# Altium schematic sheet Sheet1.SchDoc
size Letter
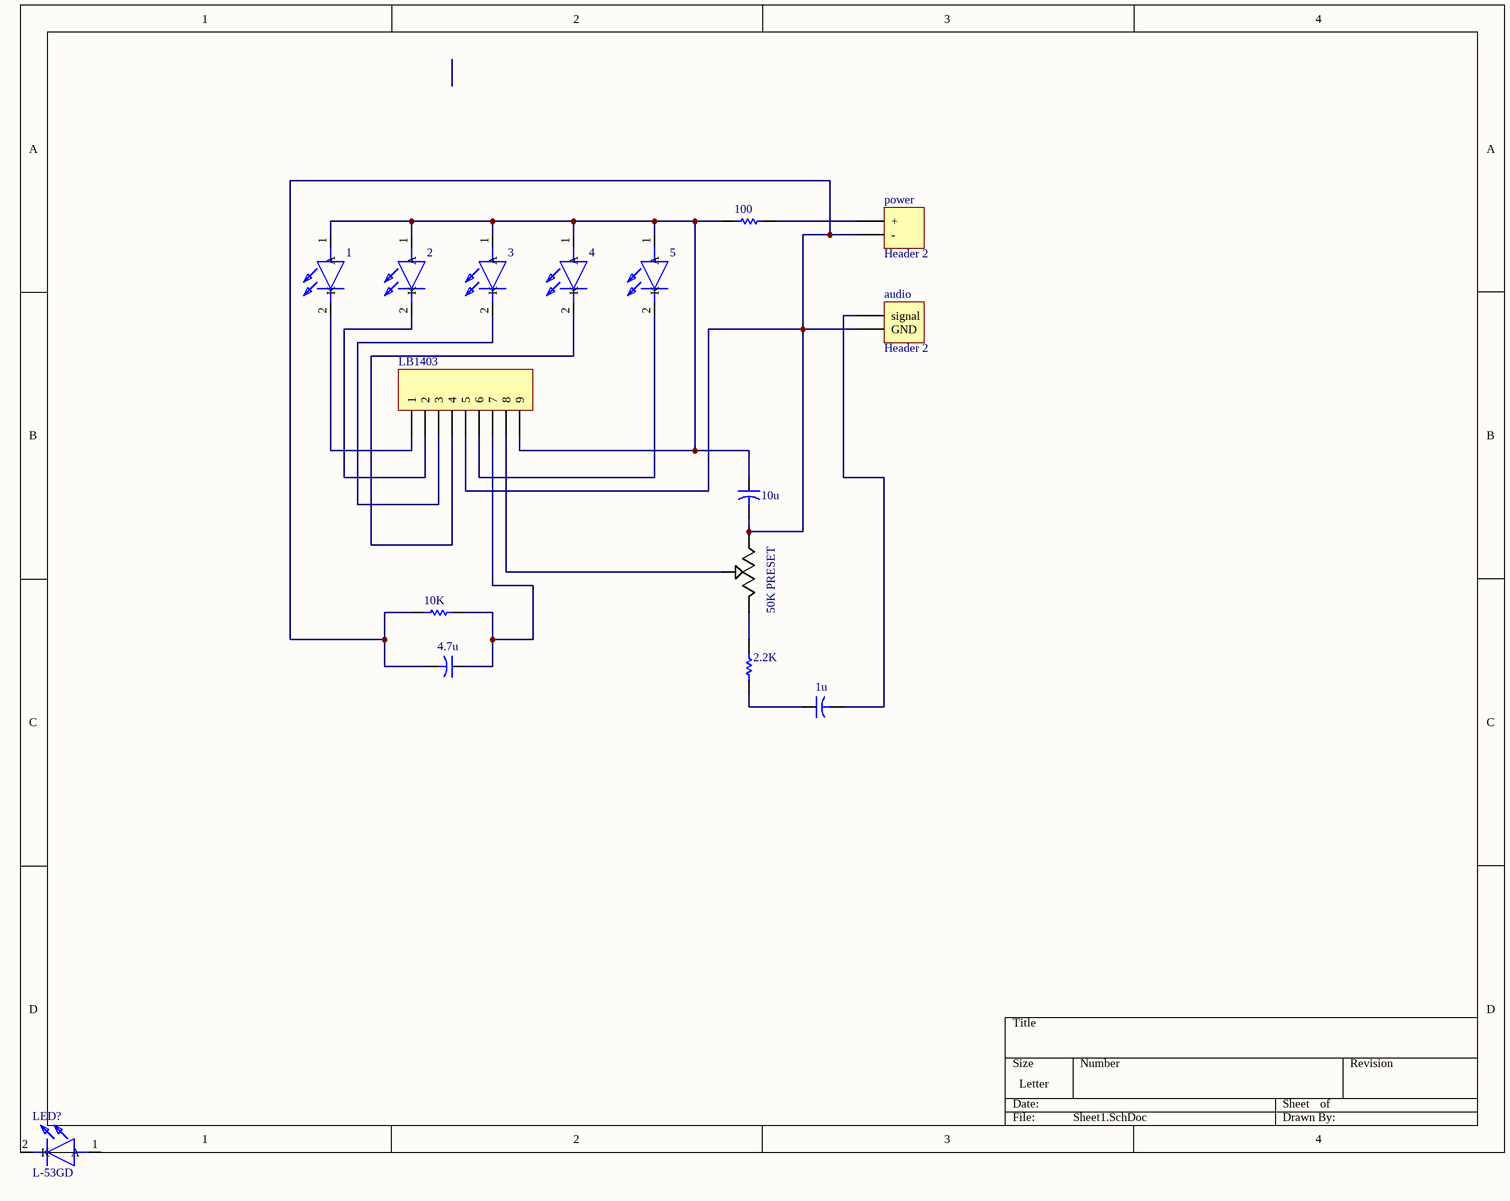
[diagram p0: Sheet1.SchDoc]

## Parts
1  L-53GD  [L-53GD]  (value not drawn)
1u  Cap2  [CAPR5-4X5]  (value not drawn)
2  L-53GD  [L-53GD]  (value not drawn)
2.2K  Res1  [AXIAL-0.3]  (value not drawn)
3  L-53GD  [L-53GD]  (value not drawn)
4  L-53GD  [L-53GD]  (value not drawn)
4.7u  Cap2  [CAPR5-4X5]  (value not drawn)
5  L-53GD  [L-53GD]  (value not drawn)
10K  Res1  [AXIAL-0.3]  (value not drawn)
10u  10u  [CAPR5-4X5]  (value not drawn)
50K_PRESET  EVN-D8AA03B14  [*TRIM_EVN-D8AA03B14]  (value not drawn)
100  Res1  [AXIAL-0.3]  (value not drawn)
audio  Header 2  [HDR1X2]
LB1403  Header 9  [HDR1X9]  (value not drawn)
LED?  L-53GD  [L-53GD]
power  Header 2  [HDR1X2]

## Nets
Net1_1: 1.1(A) 2.1(A) 3.1(A) 4.1(A) 5.1(A) 10u.1 100.1 LB1403.9
Net1_2: 1.2(K) LB1403.1
Net1u_1: 1u.1 2.2K.1
Net1u_2: 1u.2 audio.1(signal)
Net2.2K_2: 2.2K.2 50K_PRESET.3
Net2_2: 2.2(K) LB1403.2
Net3_2: 3.2(K) LB1403.3
Net4.7u_1: 4.7u.1 10K.2 LB1403.7
Net4.7u_2: 4.7u.2 10K.1 10u.2 50K_PRESET.1 audio.2(GND) LB1403.5 power.2(-)
Net4_2: 4.2(K) LB1403.4
Net5_2: 5.2(K) LB1403.6
Net50K_PRESET_2: 50K_PRESET.2 LB1403.8
Net100_2: 100.2 power.1(+)

Not connected (* = marked no-connect by the designer): LED? 1(A) 2(K)

## Library data of the parts
1-5 LED? = L-53GD: LED; Manufacturer_Name: Kingbright; Allied_Number: 70424261; Datasheet Link: http://docs-emea.rs-online.com/webdocs/151e/0900766b8151e408.pdf; Manufacturer_Part_Number: L-53GD; Mouser Part Number: N/A; Mouser Price/Stock: https://www.mouser.com/Search/Refine.aspx?Keyword=N%2FA; RS Part Number: 2286004A; RS Price/Stock: http://uk.rs-online.com/web/p/products/2286004A; Allied Price/Stock: http://www.alliedelec.com/kingbright-l-53gd/70424261/
1u 4.7u 10u = Cap2: Capacitor; Value: 100pF; Published: 23-Sep-2002; PackageReference: CAPR5-4X5; Publisher: Altium Limited; PackageDescription: Capacitor; 2 Leads
2.2K 10K 100 = Res1: Resistor; Value: 1K; Published: 8-Jun-2000; LatestRevisionDate: 17-Jul-2002; LatestRevisionNote: Re-released for DXP Platform.; PackageReference: AXIAL-0.3; Publisher: Altium Limited; PackageDescription: Axial Device, Thru-Hole; 2 Leads; 0.3 in Pin Spacing
50K_PRESET = EVN-D8AA03B14: Trimmer; Carbon; Rest 10 Kilohms; PCB; 1 Turn; Pwr-Rtg 0.1 W; Linear; Top Adj; 6 mm SQ; MF: Panasonic Electronic; Availability: Unavailable; Price: None; SnapEDA_Link: https://www.snapeda.com/parts/EVN-D8AA03B14/Panasonic%20Electronic%20Components/view-part/?ref=snap; MP: EVN-D8AA03B14; Package: PQFP-44 Panasonic; Value: *
audio power = Header 2: Header, 2-Pin; LatestRevisionDate: 17-Jul-2002; LatestRevisionNote: Re-released for DXP Platform.; Publisher: Altium Limited
LB1403 = Header 9: Header, 9-Pin; LatestRevisionDate: 17-Jul-2002; LatestRevisionNote: Re-released for DXP Platform.; Publisher: Altium Limited